# EasyEDA schematic Sheet_2.json
TITLE: 8 Bit ALU - Q XOR M; REV: 1.0; Date: 2021-12-29; Sheet: 2/3; Drawn By: Koehler, Paul; Company: komed3
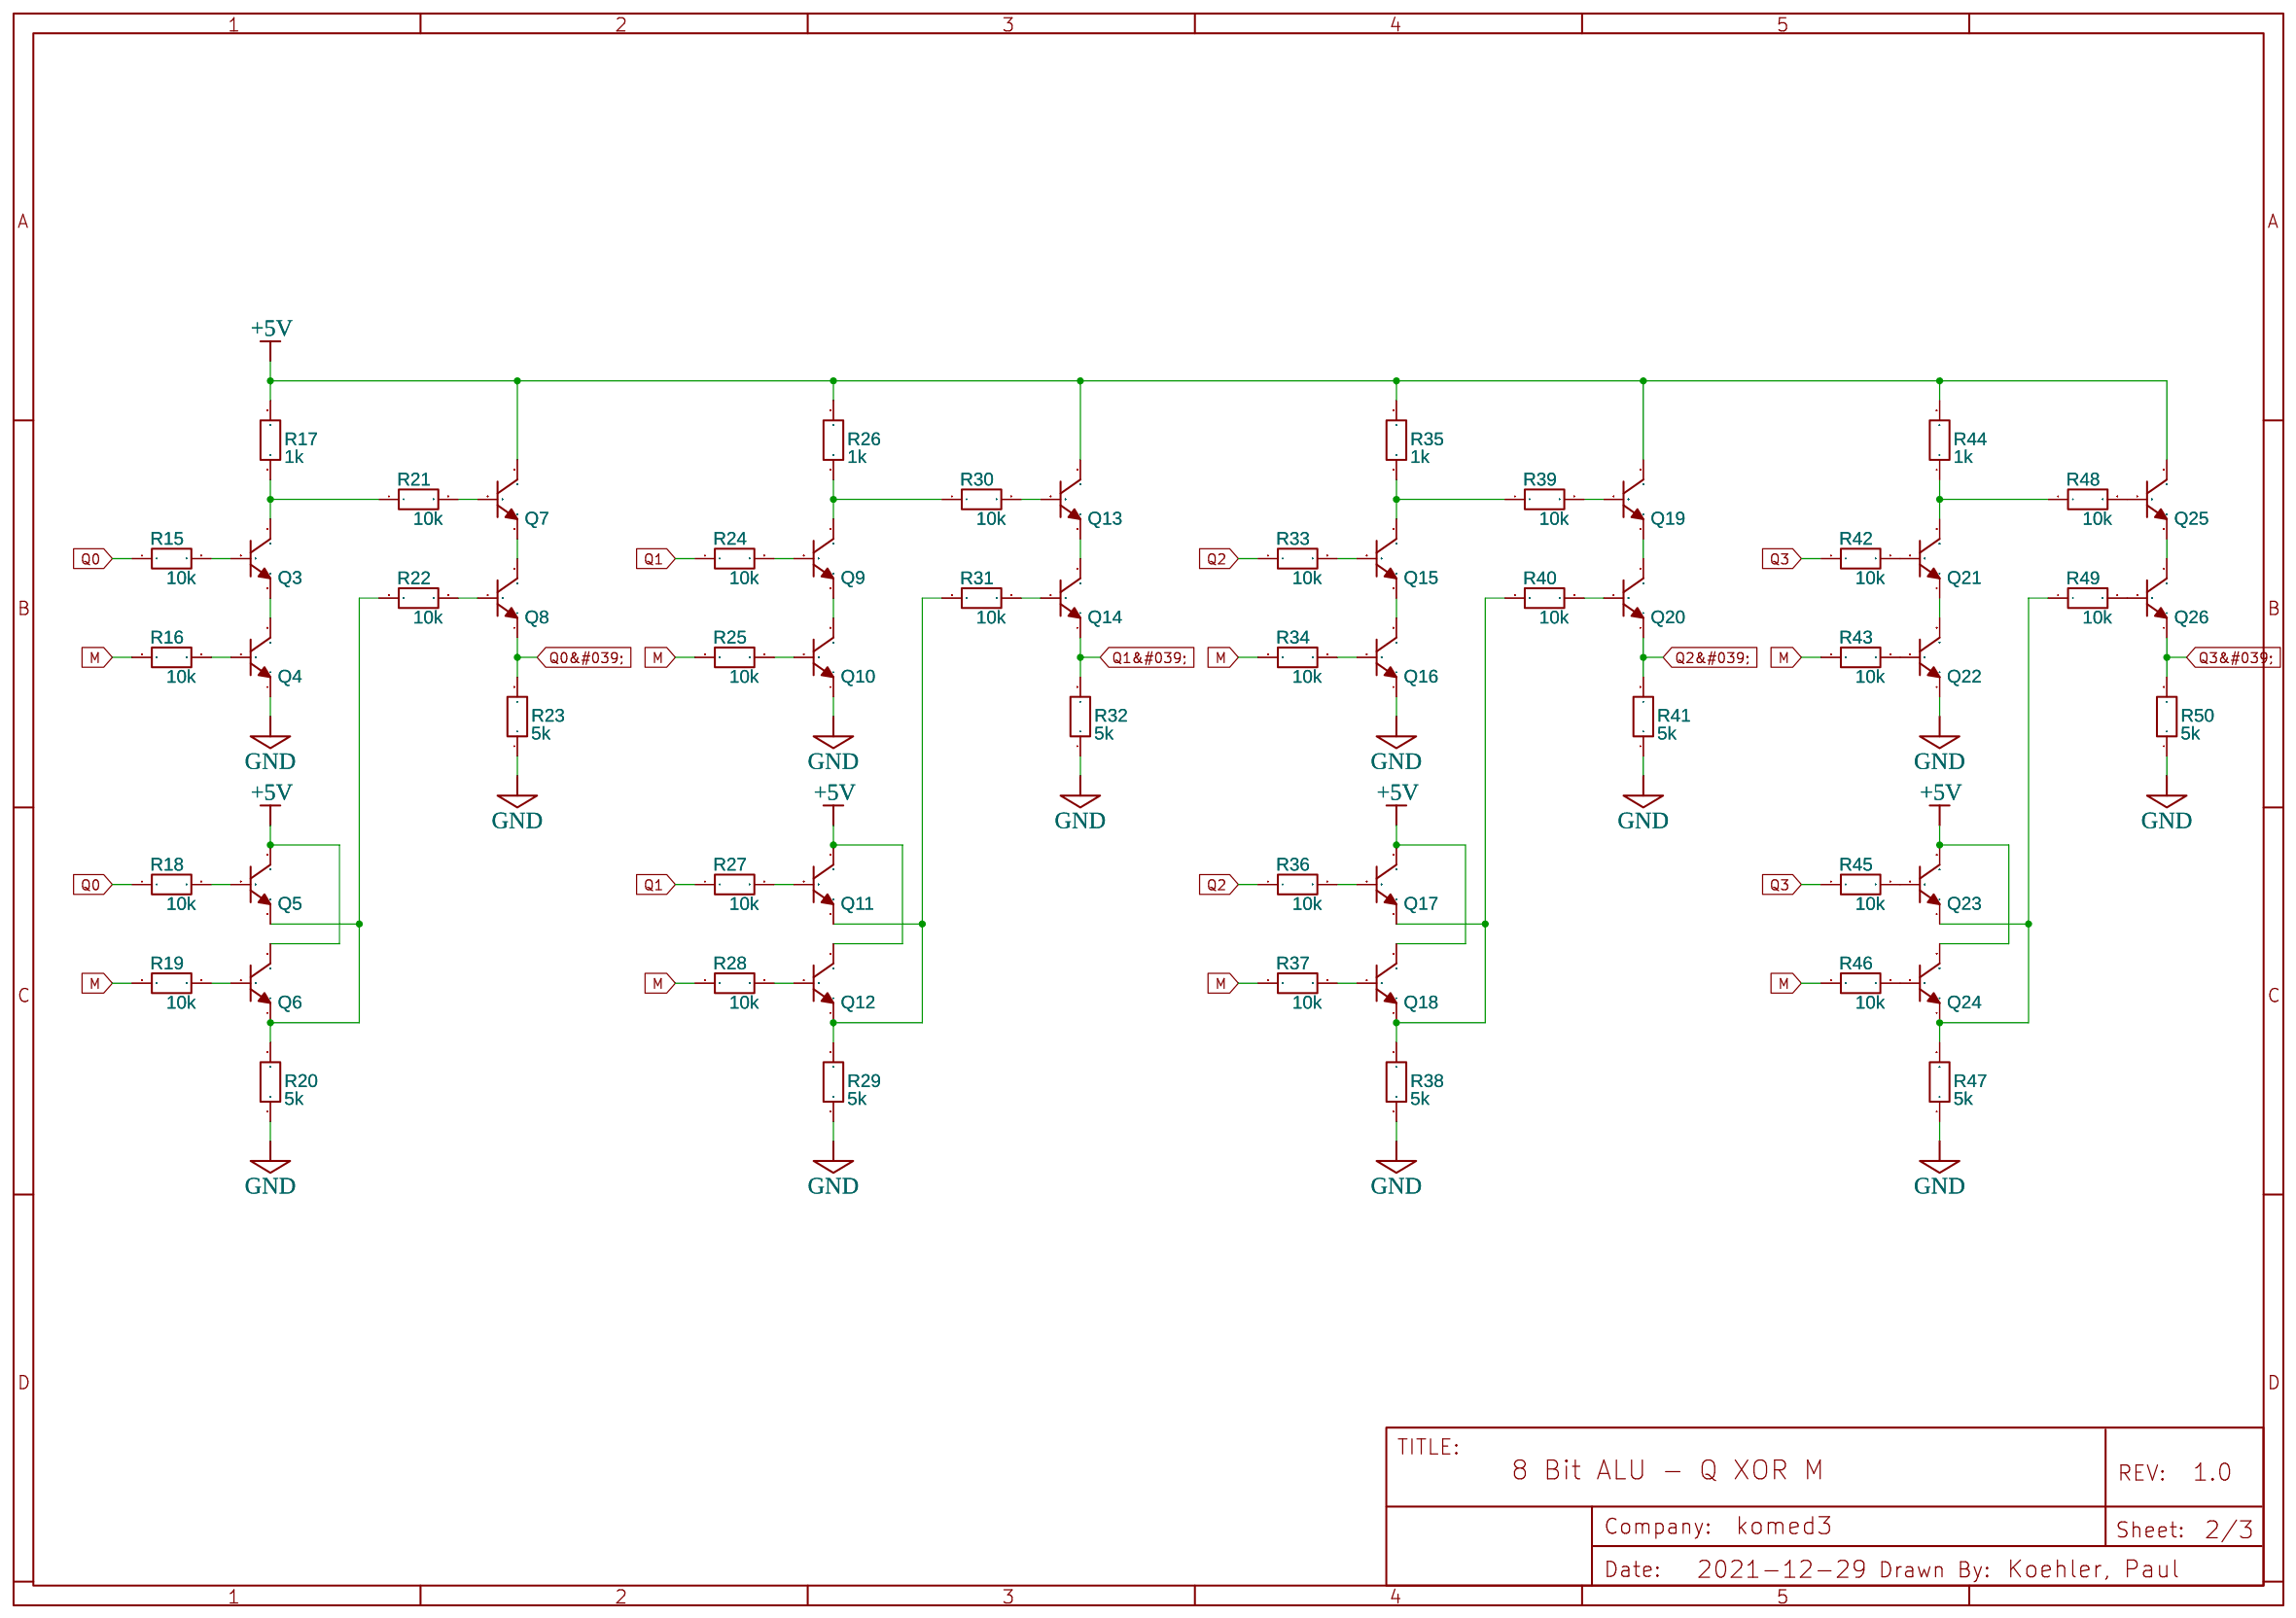
[diagram p0: schematic sheet]

## Parts
Q3  2N3904(TO-92)  [TO-92-3_L5.1-W4.1-P1.27-L]
Q4  2N3904(TO-92)  [TO-92-3_L5.1-W4.1-P1.27-L]
Q5  2N3904(TO-92)  [TO-92-3_L5.1-W4.1-P1.27-L]
Q6  2N3904(TO-92)  [TO-92-3_L5.1-W4.1-P1.27-L]
Q7  2N3904(TO-92)  [TO-92-3_L5.1-W4.1-P1.27-L]
Q8  2N3904(TO-92)  [TO-92-3_L5.1-W4.1-P1.27-L]
Q9  2N3904(TO-92)  [TO-92-3_L5.1-W4.1-P1.27-L]
Q10  2N3904(TO-92)  [TO-92-3_L5.1-W4.1-P1.27-L]
Q11  2N3904(TO-92)  [TO-92-3_L5.1-W4.1-P1.27-L]
Q12  2N3904(TO-92)  [TO-92-3_L5.1-W4.1-P1.27-L]
Q13  2N3904(TO-92)  [TO-92-3_L5.1-W4.1-P1.27-L]
Q14  2N3904(TO-92)  [TO-92-3_L5.1-W4.1-P1.27-L]
Q15  2N3904(TO-92)  [TO-92-3_L5.1-W4.1-P1.27-L]
Q16  2N3904(TO-92)  [TO-92-3_L5.1-W4.1-P1.27-L]
Q17  2N3904(TO-92)  [TO-92-3_L5.1-W4.1-P1.27-L]
Q18  2N3904(TO-92)  [TO-92-3_L5.1-W4.1-P1.27-L]
Q19  2N3904(TO-92)  [TO-92-3_L5.1-W4.1-P1.27-L]
Q20  2N3904(TO-92)  [TO-92-3_L5.1-W4.1-P1.27-L]
Q21  2N3904(TO-92)  [TO-92-3_L5.1-W4.1-P1.27-L]
Q22  2N3904(TO-92)  [TO-92-3_L5.1-W4.1-P1.27-L]
Q23  2N3904(TO-92)  [TO-92-3_L5.1-W4.1-P1.27-L]
Q24  2N3904(TO-92)  [TO-92-3_L5.1-W4.1-P1.27-L]
Q25  2N3904(TO-92)  [TO-92-3_L5.1-W4.1-P1.27-L]
Q26  2N3904(TO-92)  [TO-92-3_L5.1-W4.1-P1.27-L]
R15  10k  [RESISTOR-1/2W-VERTICAL]
R16  10k  [RESISTOR-1/2W-VERTICAL]
R17  1k  [RESISTOR-1/2W-VERTICAL]
R18  10k  [RESISTOR-1/2W-VERTICAL]
R19  10k  [RESISTOR-1/2W-VERTICAL]
R20  5k  [RESISTOR-1/2W-VERTICAL]
R21  10k  [RESISTOR-1/2W-VERTICAL]
R22  10k  [RESISTOR-1/2W-VERTICAL]
R23  5k  [RESISTOR-1/2W-VERTICAL]
R24  10k  [RESISTOR-1/2W-VERTICAL]
R25  10k  [RESISTOR-1/2W-VERTICAL]
R26  1k  [RESISTOR-1/2W-VERTICAL]
R27  10k  [RESISTOR-1/2W-VERTICAL]
R28  10k  [RESISTOR-1/2W-VERTICAL]
R29  5k  [RESISTOR-1/2W-VERTICAL]
R30  10k  [RESISTOR-1/2W-VERTICAL]
R31  10k  [RESISTOR-1/2W-VERTICAL]
R32  5k  [RESISTOR-1/2W-VERTICAL]
R33  10k  [RESISTOR-1/2W-VERTICAL]
R34  10k  [RESISTOR-1/2W-VERTICAL]
R35  1k  [RESISTOR-1/2W-VERTICAL]
R36  10k  [RESISTOR-1/2W-VERTICAL]
R37  10k  [RESISTOR-1/2W-VERTICAL]
R38  5k  [RESISTOR-1/2W-VERTICAL]
R39  10k  [RESISTOR-1/2W-VERTICAL]
R40  10k  [RESISTOR-1/2W-VERTICAL]
R41  5k  [RESISTOR-1/2W-VERTICAL]
R42  10k  [RESISTOR-1/2W-VERTICAL]
R43  10k  [RESISTOR-1/2W-VERTICAL]
R44  1k  [RESISTOR-1/2W-VERTICAL]
R45  10k  [RESISTOR-1/2W-VERTICAL]
R46  10k  [RESISTOR-1/2W-VERTICAL]
R47  5k  [RESISTOR-1/2W-VERTICAL]
R48  10k  [RESISTOR-1/2W-VERTICAL]
R49  10k  [RESISTOR-1/2W-VERTICAL]
R50  5k  [RESISTOR-1/2W-VERTICAL]

## Library data of the parts
Q3-Q26 = 2N3904(TO-92): Supplier: LCSC; Manufacturer: SEMTECH; Manufacturer Part: 2N3904; Supplier Part: C118538; Contributor: LCEDA_Lib
R15-R50 = R_AXIAL-0.3_EU: Contributor: LCEDA_Lib

## Nets
+5V: Q5.3(C) Q6.3(C) Q7.3(C) Q11.3(C) Q12.3(C) Q13.3(C) Q17.3(C) Q18.3(C) Q19.3(C) Q23.3(C) Q24.3(C) Q25.3(C) R17.2 R26.2 R35.2 R44.2
GND: Q4.1(E) Q10.1(E) Q16.1(E) Q22.1(E) R20.1 R23.1 R29.1 R32.1 R38.1 R41.1 R47.1 R50.1
M: R16.1 R19.1 R25.1 R28.1 R34.1 R37.1 R43.1 R46.1
Q0: R15.1 R18.1
Q0&#039;: Q8.1(E) R23.2
Q1: R24.1 R27.1
Q1&#039;: Q14.1(E) R32.2
Q2: R33.1 R36.1
Q2&#039;: Q20.1(E) R41.2
Q3: R42.1 R45.1
Q3&#039;: Q26.1(E) R50.2
Net-(Q3-1): Q3.1(E) Q4.3(C)
Net-(Q3-2): Q3.2(B) R15.2
Net-(Q3-3): Q3.3(C) R17.1 R21.1
Net-(Q4-2): Q4.2(B) R16.2
Net-(Q5-1): Q5.1(E) Q6.1(E) R20.2 R22.1
Net-(Q5-2): Q5.2(B) R18.2
Net-(Q6-2): Q6.2(B) R19.2
Net-(Q7-1): Q7.1(E) Q8.3(C)
Net-(Q7-2): Q7.2(B) R21.2
Net-(Q8-2): Q8.2(B) R22.2
Net-(Q9-1): Q9.1(E) Q10.3(C)
Net-(Q9-2): Q9.2(B) R24.2
Net-(Q9-3): Q9.3(C) R26.1 R30.1
Net-(Q10-2): Q10.2(B) R25.2
Net-(Q11-1): Q11.1(E) Q12.1(E) R29.2 R31.1
Net-(Q11-2): Q11.2(B) R27.2
Net-(Q12-2): Q12.2(B) R28.2
Net-(Q13-1): Q13.1(E) Q14.3(C)
Net-(Q13-2): Q13.2(B) R30.2
Net-(Q14-2): Q14.2(B) R31.2
Net-(Q15-1): Q15.1(E) Q16.3(C)
Net-(Q15-2): Q15.2(B) R33.2
Net-(Q15-3): Q15.3(C) R35.1 R39.1
Net-(Q16-2): Q16.2(B) R34.2
Net-(Q17-1): Q17.1(E) Q18.1(E) R38.2 R40.1
Net-(Q17-2): Q17.2(B) R36.2
Net-(Q18-2): Q18.2(B) R37.2
Net-(Q19-1): Q19.1(E) Q20.3(C)
Net-(Q19-2): Q19.2(B) R39.2
Net-(Q20-2): Q20.2(B) R40.2
Net-(Q21-1): Q21.1(E) Q22.3(C)
Net-(Q21-2): Q21.2(B) R42.2
Net-(Q21-3): Q21.3(C) R44.1 R48.1
Net-(Q22-2): Q22.2(B) R43.2
Net-(Q23-1): Q23.1(E) Q24.1(E) R47.2 R49.1
Net-(Q23-2): Q23.2(B) R45.2
Net-(Q24-2): Q24.2(B) R46.2
Net-(Q25-1): Q25.1(E) Q26.3(C)
Net-(Q25-2): Q25.2(B) R48.2
Net-(Q26-2): Q26.2(B) R49.2
